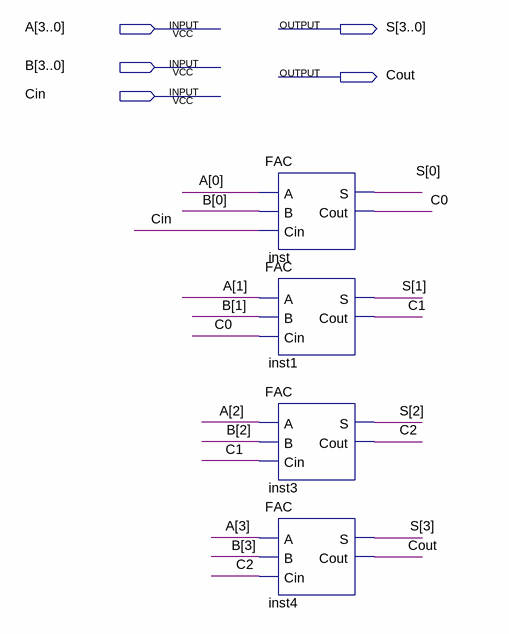
[diagram p0: schematic sheet]
// Quartus schematic RCA4.bdf as structural Verilog: 4 symbols, 5 pins
module RCA4 (
  input  [3:0] A,
  input  [3:0] B,
  input  Cin,
  output [3:0] S,
  output Cout
);

  wire C0, C1, C2;

  FAC inst (.A(A[0]), .B(B[0]), .Cin(Cin), .S(S[0]), .Cout(C0));
  FAC inst1 (.A(A[1]), .B(B[1]), .Cin(C0), .S(S[1]), .Cout(C1));
  FAC inst3 (.A(A[2]), .B(B[2]), .Cin(C1), .S(S[2]), .Cout(C2));
  FAC inst4 (.A(A[3]), .B(B[3]), .Cin(C2), .S(S[3]), .Cout(Cout));
endmodule
